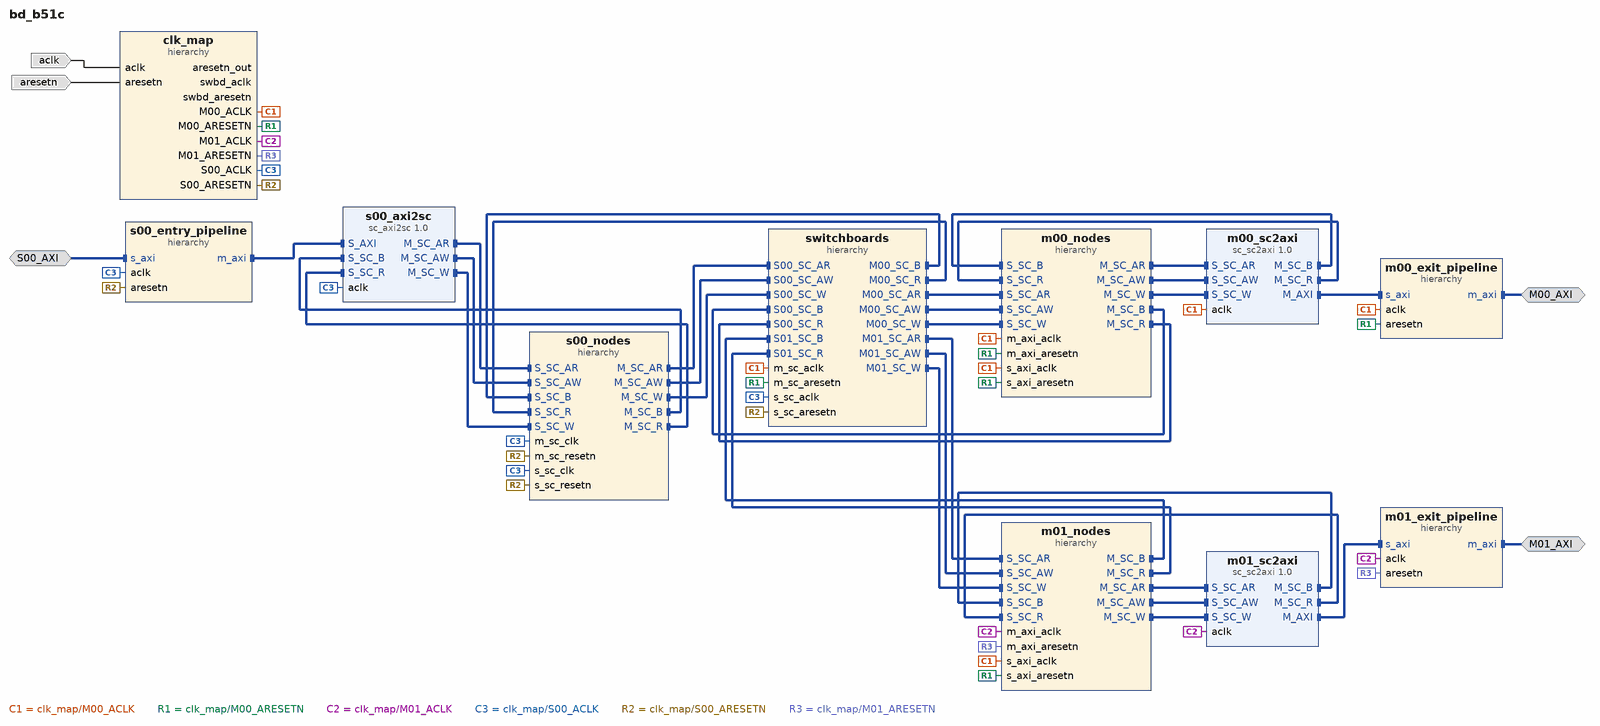
[diagram p0: block diagram of the top level]
# Vivado block design bd_b51c, xc7z007sclg400-1, Vivado 2024.2
create_bd_design bd_b51c

create_bd_intf_port -mode Slave -vlnv xilinx.com:interface:aximm_rtl:1.0 S00_AXI
set_property -dict {CONFIG.NUM_READ_OUTSTANDING 8 CONFIG.NUM_WRITE_OUTSTANDING 8} [get_bd_intf_ports S00_AXI]
create_bd_intf_port -mode Master -vlnv xilinx.com:interface:aximm_rtl:1.0 M00_AXI
set_property -dict [list \
  CONFIG.NUM_READ_OUTSTANDING 8 \
  CONFIG.NUM_READ_THREADS 1 \
  CONFIG.NUM_WRITE_OUTSTANDING 8 \
  CONFIG.NUM_WRITE_THREADS 1 \
  CONFIG.RUSER_BITS_PER_BYTE 0 \
  CONFIG.WUSER_BITS_PER_BYTE 0 \
] [get_bd_intf_ports M00_AXI]
create_bd_intf_port -mode Master -vlnv xilinx.com:interface:aximm_rtl:1.0 M01_AXI
set_property -dict [list \
  CONFIG.NUM_READ_OUTSTANDING 8 \
  CONFIG.NUM_READ_THREADS 1 \
  CONFIG.NUM_WRITE_OUTSTANDING 8 \
  CONFIG.NUM_WRITE_THREADS 1 \
  CONFIG.RUSER_BITS_PER_BYTE 0 \
  CONFIG.WUSER_BITS_PER_BYTE 0 \
] [get_bd_intf_ports M01_AXI]
create_bd_port -dir I -type clk aclk
set_property -dict {CONFIG.ASSOCIATED_BUSIF M00_AXI:M01_AXI:S00_AXI} [get_bd_ports aclk]
create_bd_port -dir I -type rst aresetn
set_property -dict {CONFIG.POLARITY ACTIVE_LOW} [get_bd_ports aresetn]

create_bd_cell -type hier clk_map
create_bd_cell -type hier switchboards
create_bd_cell -type hier s00_entry_pipeline
create_bd_cell -type ip -vlnv xilinx.com:ip:sc_axi2sc:1.0 s00_axi2sc
set_property -dict [list \
  CONFIG.AXI_ADDR_WIDTH 32 \
  CONFIG.AXI_ID_WIDTH 1 \
  CONFIG.AXI_RDATA_WIDTH 32 \
  CONFIG.AXI_WDATA_WIDTH 32 \
  CONFIG.MSC_ROUTE_WIDTH 4 \
  CONFIG.READ_WRITE_MODE READ_WRITE \
  CONFIG.SC_ADDR_WIDTH 32 \
  CONFIG.SC_ARUSER_WIDTH 0 \
  CONFIG.SC_AWUSER_WIDTH 0 \
  CONFIG.SC_BUSER_WIDTH 0 \
  CONFIG.SC_ID_WIDTH 1 \
  CONFIG.SC_RDATA_WIDTH 32 \
  CONFIG.SC_RUSER_BITS_PER_BYTE 0 \
  CONFIG.SC_WDATA_WIDTH 32 \
  CONFIG.SC_WUSER_BITS_PER_BYTE 0 \
  CONFIG.SSC_ROUTE_WIDTH 3 \
] [get_bd_cells s00_axi2sc]
create_bd_cell -type hier s00_nodes
create_bd_cell -type ip -vlnv xilinx.com:ip:sc_sc2axi:1.0 m00_sc2axi
set_property -dict [list \
  CONFIG.AXI_ADDR_WIDTH 9 \
  CONFIG.AXI_ID_WIDTH 1 \
  CONFIG.AXI_RDATA_WIDTH 32 \
  CONFIG.AXI_WDATA_WIDTH 32 \
  CONFIG.MSC_ROUTE_WIDTH 4 \
  CONFIG.READ_WRITE_MODE READ_WRITE \
  CONFIG.SC_ADDR_WIDTH 32 \
  CONFIG.SC_ARUSER_WIDTH 0 \
  CONFIG.SC_AWUSER_WIDTH 0 \
  CONFIG.SC_BUSER_WIDTH 0 \
  CONFIG.SC_ID_WIDTH 1 \
  CONFIG.SC_RDATA_WIDTH 32 \
  CONFIG.SC_RUSER_BITS_PER_BYTE 0 \
  CONFIG.SC_WDATA_WIDTH 32 \
  CONFIG.SC_WUSER_BITS_PER_BYTE 0 \
  CONFIG.SSC_ROUTE_WIDTH 3 \
] [get_bd_cells m00_sc2axi]
create_bd_cell -type hier m00_nodes
create_bd_cell -type hier m00_exit_pipeline
create_bd_cell -type ip -vlnv xilinx.com:ip:sc_sc2axi:1.0 m01_sc2axi
set_property -dict [list \
  CONFIG.AXI_ADDR_WIDTH 10 \
  CONFIG.AXI_ID_WIDTH 1 \
  CONFIG.AXI_RDATA_WIDTH 32 \
  CONFIG.AXI_WDATA_WIDTH 32 \
  CONFIG.MSC_ROUTE_WIDTH 4 \
  CONFIG.READ_WRITE_MODE READ_WRITE \
  CONFIG.SC_ADDR_WIDTH 32 \
  CONFIG.SC_ARUSER_WIDTH 0 \
  CONFIG.SC_AWUSER_WIDTH 0 \
  CONFIG.SC_BUSER_WIDTH 0 \
  CONFIG.SC_ID_WIDTH 1 \
  CONFIG.SC_RDATA_WIDTH 32 \
  CONFIG.SC_RUSER_BITS_PER_BYTE 0 \
  CONFIG.SC_WDATA_WIDTH 32 \
  CONFIG.SC_WUSER_BITS_PER_BYTE 0 \
  CONFIG.SSC_ROUTE_WIDTH 3 \
] [get_bd_cells m01_sc2axi]
create_bd_cell -type hier m01_nodes
create_bd_cell -type hier m01_exit_pipeline

# ---- hierarchy /clk_map ----
current_bd_instance /clk_map
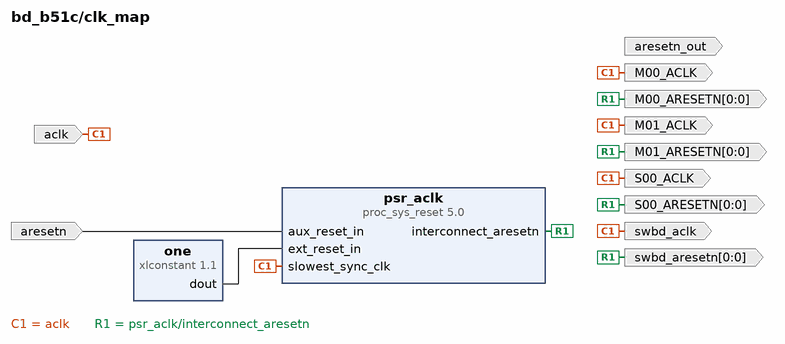
[diagram p1: block diagram inside /clk_map]
create_bd_pin -dir O -type clk S00_ACLK
create_bd_pin -dir O -from 0 -to 0 -type rst S00_ARESETN
create_bd_pin -dir O -type clk M00_ACLK
create_bd_pin -dir O -from 0 -to 0 -type rst M00_ARESETN
create_bd_pin -dir O -type clk M01_ACLK
create_bd_pin -dir O -from 0 -to 0 -type rst M01_ARESETN
create_bd_pin -dir O -type clk swbd_aclk
create_bd_pin -dir O -from 0 -to 0 -type rst swbd_aresetn
create_bd_pin -dir I -type rst aresetn
create_bd_pin -dir O -type rst aresetn_out
create_bd_pin -dir I -type clk aclk

create_bd_cell -type ip -vlnv xilinx.com:ip:xlconstant:1.1 one
create_bd_cell -type ip -vlnv xilinx.com:ip:proc_sys_reset:5.0 psr_aclk
set_property -dict {CONFIG.C_AUX_RESET_HIGH 0 CONFIG.C_AUX_RST_WIDTH 1} [get_bd_cells psr_aclk]

# ---- hierarchy /switchboards ----
current_bd_instance /switchboards
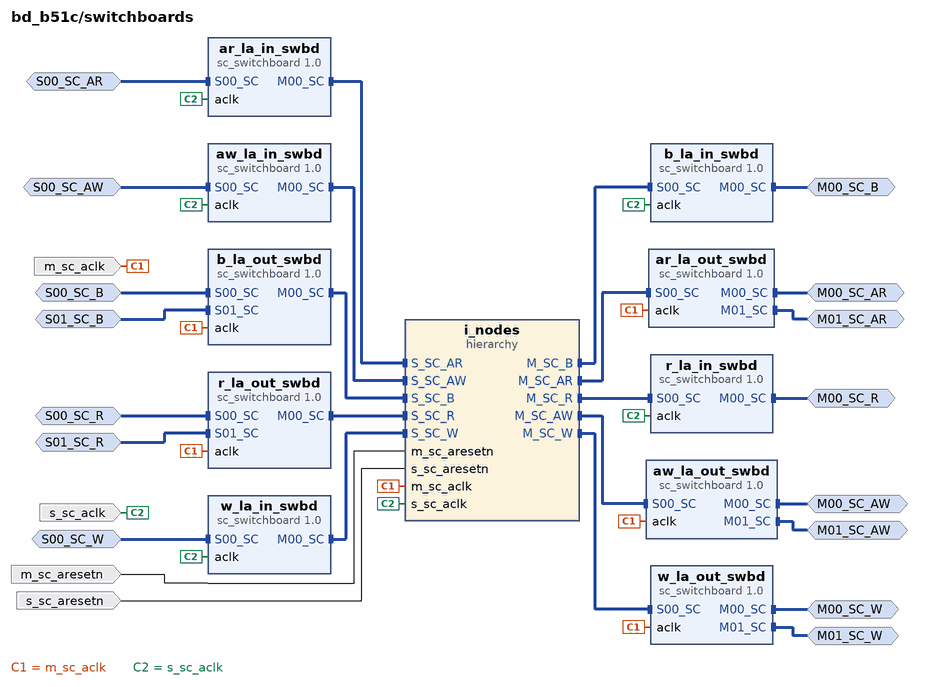
[diagram p2: block diagram inside /switchboards]
create_bd_intf_pin -mode Slave -vlnv xilinx.com:interface:sc_rtl:1.0 S00_SC_AR
create_bd_intf_pin -mode Slave -vlnv xilinx.com:interface:sc_rtl:1.0 S00_SC_AW
create_bd_intf_pin -mode Master -vlnv xilinx.com:interface:sc_rtl:1.0 M00_SC_B
create_bd_intf_pin -mode Master -vlnv xilinx.com:interface:sc_rtl:1.0 M00_SC_R
create_bd_intf_pin -mode Slave -vlnv xilinx.com:interface:sc_rtl:1.0 S00_SC_W
create_bd_intf_pin -mode Master -vlnv xilinx.com:interface:sc_rtl:1.0 M00_SC_AR
create_bd_intf_pin -mode Master -vlnv xilinx.com:interface:sc_rtl:1.0 M01_SC_AR
create_bd_intf_pin -mode Master -vlnv xilinx.com:interface:sc_rtl:1.0 M00_SC_AW
create_bd_intf_pin -mode Master -vlnv xilinx.com:interface:sc_rtl:1.0 M01_SC_AW
create_bd_intf_pin -mode Slave -vlnv xilinx.com:interface:sc_rtl:1.0 S00_SC_B
create_bd_intf_pin -mode Slave -vlnv xilinx.com:interface:sc_rtl:1.0 S01_SC_B
create_bd_intf_pin -mode Slave -vlnv xilinx.com:interface:sc_rtl:1.0 S00_SC_R
create_bd_intf_pin -mode Slave -vlnv xilinx.com:interface:sc_rtl:1.0 S01_SC_R
create_bd_intf_pin -mode Master -vlnv xilinx.com:interface:sc_rtl:1.0 M00_SC_W
create_bd_intf_pin -mode Master -vlnv xilinx.com:interface:sc_rtl:1.0 M01_SC_W
create_bd_pin -dir I -type clk s_sc_aclk
create_bd_pin -dir I -type clk m_sc_aclk
create_bd_pin -dir I -type rst s_sc_aresetn
create_bd_pin -dir I -type rst m_sc_aresetn

create_bd_cell -type ip -vlnv xilinx.com:ip:sc_switchboard:1.0 ar_la_in_swbd
set_property -dict {CONFIG.NUM_MI 1 CONFIG.NUM_SI 1 CONFIG.PAYLD_WIDTH 141} [get_bd_cells ar_la_in_swbd]
create_bd_cell -type ip -vlnv xilinx.com:ip:sc_switchboard:1.0 r_la_in_swbd
set_property -dict {CONFIG.NUM_MI 1 CONFIG.NUM_SI 1 CONFIG.PAYLD_WIDTH 53} [get_bd_cells r_la_in_swbd]
create_bd_cell -type ip -vlnv xilinx.com:ip:sc_switchboard:1.0 aw_la_in_swbd
set_property -dict {CONFIG.NUM_MI 1 CONFIG.NUM_SI 1 CONFIG.PAYLD_WIDTH 141} [get_bd_cells aw_la_in_swbd]
create_bd_cell -type ip -vlnv xilinx.com:ip:sc_switchboard:1.0 w_la_in_swbd
set_property -dict {CONFIG.NUM_MI 1 CONFIG.NUM_SI 1 CONFIG.PAYLD_WIDTH 55} [get_bd_cells w_la_in_swbd]
create_bd_cell -type ip -vlnv xilinx.com:ip:sc_switchboard:1.0 b_la_in_swbd
set_property -dict {CONFIG.NUM_MI 1 CONFIG.NUM_SI 1 CONFIG.PAYLD_WIDTH 7} [get_bd_cells b_la_in_swbd]
create_bd_cell -type ip -vlnv xilinx.com:ip:sc_switchboard:1.0 ar_la_out_swbd
set_property -dict {CONFIG.NUM_MI 2 CONFIG.NUM_SI 1 CONFIG.PAYLD_WIDTH 141} [get_bd_cells ar_la_out_swbd]
create_bd_cell -type ip -vlnv xilinx.com:ip:sc_switchboard:1.0 r_la_out_swbd
set_property -dict {CONFIG.NUM_MI 1 CONFIG.NUM_SI 2 CONFIG.PAYLD_WIDTH 53} [get_bd_cells r_la_out_swbd]
create_bd_cell -type ip -vlnv xilinx.com:ip:sc_switchboard:1.0 aw_la_out_swbd
set_property -dict {CONFIG.NUM_MI 2 CONFIG.NUM_SI 1 CONFIG.PAYLD_WIDTH 141} [get_bd_cells aw_la_out_swbd]
create_bd_cell -type ip -vlnv xilinx.com:ip:sc_switchboard:1.0 w_la_out_swbd
set_property -dict {CONFIG.NUM_MI 2 CONFIG.NUM_SI 1 CONFIG.PAYLD_WIDTH 55} [get_bd_cells w_la_out_swbd]
create_bd_cell -type ip -vlnv xilinx.com:ip:sc_switchboard:1.0 b_la_out_swbd
set_property -dict {CONFIG.NUM_MI 1 CONFIG.NUM_SI 2 CONFIG.PAYLD_WIDTH 7} [get_bd_cells b_la_out_swbd]
create_bd_cell -type hier i_nodes

# ---- hierarchy /switchboards/i_nodes ----
current_bd_instance /switchboards/i_nodes
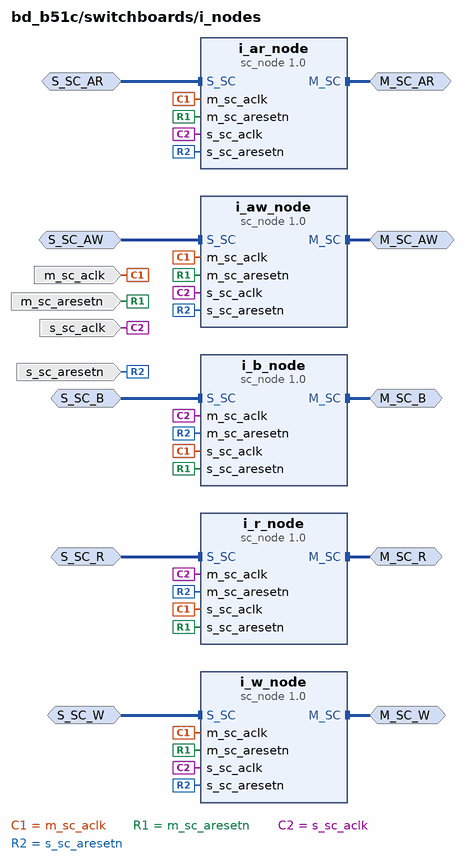
[diagram p3: block diagram inside /switchboards/i_nodes]
create_bd_intf_pin -mode Master -vlnv xilinx.com:interface:sc_rtl:1.0 M_SC_AR
create_bd_intf_pin -mode Slave -vlnv xilinx.com:interface:sc_rtl:1.0 S_SC_AR
create_bd_intf_pin -mode Master -vlnv xilinx.com:interface:sc_rtl:1.0 M_SC_R
create_bd_intf_pin -mode Slave -vlnv xilinx.com:interface:sc_rtl:1.0 S_SC_R
create_bd_intf_pin -mode Master -vlnv xilinx.com:interface:sc_rtl:1.0 M_SC_AW
create_bd_intf_pin -mode Slave -vlnv xilinx.com:interface:sc_rtl:1.0 S_SC_AW
create_bd_intf_pin -mode Master -vlnv xilinx.com:interface:sc_rtl:1.0 M_SC_W
create_bd_intf_pin -mode Slave -vlnv xilinx.com:interface:sc_rtl:1.0 S_SC_W
create_bd_intf_pin -mode Master -vlnv xilinx.com:interface:sc_rtl:1.0 M_SC_B
create_bd_intf_pin -mode Slave -vlnv xilinx.com:interface:sc_rtl:1.0 S_SC_B
create_bd_pin -dir I -type clk s_sc_aclk
create_bd_pin -dir I -type clk m_sc_aclk
create_bd_pin -dir I -type rst s_sc_aresetn
create_bd_pin -dir I -type rst m_sc_aresetn

create_bd_cell -type ip -vlnv xilinx.com:ip:sc_node:1.0 i_ar_node
set_property -dict [list \
  CONFIG.ACLKEN_CONVERSION 0 \
  CONFIG.ACLK_RELATIONSHIP 1 \
  CONFIG.ADDR_WIDTH 32 \
  CONFIG.CHANNEL 2 \
  CONFIG.FIFO_SIZE 0 \
  CONFIG.FIFO_TYPE 0 \
  CONFIG.ID_WIDTH 1 \
  CONFIG.M00_NUM_BYTES 4 \
  CONFIG.M01_NUM_BYTES 4 \
  CONFIG.M02_NUM_BYTES 4 \
  CONFIG.M03_NUM_BYTES 4 \
  CONFIG.M04_NUM_BYTES 4 \
  CONFIG.M05_NUM_BYTES 4 \
  CONFIG.M06_NUM_BYTES 4 \
  CONFIG.M07_NUM_BYTES 4 \
  CONFIG.M08_NUM_BYTES 4 \
  CONFIG.M09_NUM_BYTES 4 \
  CONFIG.M10_NUM_BYTES 4 \
  CONFIG.M11_NUM_BYTES 4 \
  CONFIG.M12_NUM_BYTES 4 \
  CONFIG.M13_NUM_BYTES 4 \
  CONFIG.M14_NUM_BYTES 4 \
  CONFIG.M15_NUM_BYTES 4 \
  CONFIG.MAX_PAYLD_BYTES 4 \
  CONFIG.M_SEND_PIPELINE 0 \
  CONFIG.NUM_MI 2 \
  CONFIG.NUM_OUTSTANDING 8 \
  CONFIG.NUM_SI 1 \
  CONFIG.PAYLD_WIDTH 141 \
  CONFIG.S00_NUM_BYTES 4 \
  CONFIG.S01_NUM_BYTES 4 \
  CONFIG.S02_NUM_BYTES 4 \
  CONFIG.S03_NUM_BYTES 4 \
  CONFIG.S04_NUM_BYTES 4 \
  CONFIG.S05_NUM_BYTES 4 \
  CONFIG.S06_NUM_BYTES 4 \
  CONFIG.S07_NUM_BYTES 4 \
  CONFIG.S08_NUM_BYTES 4 \
  CONFIG.S09_NUM_BYTES 4 \
  CONFIG.S10_NUM_BYTES 4 \
  CONFIG.S11_NUM_BYTES 4 \
  CONFIG.S12_NUM_BYTES 4 \
  CONFIG.S13_NUM_BYTES 4 \
  CONFIG.S14_NUM_BYTES 4 \
  CONFIG.S15_NUM_BYTES 4 \
  CONFIG.SC_ROUTE_WIDTH 4 \
  CONFIG.USER_WIDTH 0 \
] [get_bd_cells i_ar_node]
create_bd_cell -type ip -vlnv xilinx.com:ip:sc_node:1.0 i_r_node
set_property -dict [list \
  CONFIG.ACLKEN_CONVERSION 0 \
  CONFIG.ACLK_RELATIONSHIP 1 \
  CONFIG.ADDR_WIDTH 32 \
  CONFIG.CHANNEL 0 \
  CONFIG.FIFO_SIZE 0 \
  CONFIG.FIFO_TYPE 0 \
  CONFIG.ID_WIDTH 1 \
  CONFIG.M00_NUM_BYTES 4 \
  CONFIG.M01_NUM_BYTES 4 \
  CONFIG.M02_NUM_BYTES 4 \
  CONFIG.M03_NUM_BYTES 4 \
  CONFIG.M04_NUM_BYTES 4 \
  CONFIG.M05_NUM_BYTES 4 \
  CONFIG.M06_NUM_BYTES 4 \
  CONFIG.M07_NUM_BYTES 4 \
  CONFIG.M08_NUM_BYTES 4 \
  CONFIG.M09_NUM_BYTES 4 \
  CONFIG.M10_NUM_BYTES 4 \
  CONFIG.M11_NUM_BYTES 4 \
  CONFIG.M12_NUM_BYTES 4 \
  CONFIG.M13_NUM_BYTES 4 \
  CONFIG.M14_NUM_BYTES 4 \
  CONFIG.M15_NUM_BYTES 4 \
  CONFIG.MAX_PAYLD_BYTES 4 \
  CONFIG.M_SEND_PIPELINE 0 \
  CONFIG.NUM_MI 1 \
  CONFIG.NUM_OUTSTANDING 8 \
  CONFIG.NUM_SI 2 \
  CONFIG.PAYLD_WIDTH 53 \
  CONFIG.S00_NUM_BYTES 4 \
  CONFIG.S01_NUM_BYTES 4 \
  CONFIG.S02_NUM_BYTES 4 \
  CONFIG.S03_NUM_BYTES 4 \
  CONFIG.S04_NUM_BYTES 4 \
  CONFIG.S05_NUM_BYTES 4 \
  CONFIG.S06_NUM_BYTES 4 \
  CONFIG.S07_NUM_BYTES 4 \
  CONFIG.S08_NUM_BYTES 4 \
  CONFIG.S09_NUM_BYTES 4 \
  CONFIG.S10_NUM_BYTES 4 \
  CONFIG.S11_NUM_BYTES 4 \
  CONFIG.S12_NUM_BYTES 4 \
  CONFIG.S13_NUM_BYTES 4 \
  CONFIG.S14_NUM_BYTES 4 \
  CONFIG.S15_NUM_BYTES 4 \
  CONFIG.SC_ROUTE_WIDTH 3 \
  CONFIG.USER_BITS_PER_BYTE 0 \
] [get_bd_cells i_r_node]
create_bd_cell -type ip -vlnv xilinx.com:ip:sc_node:1.0 i_aw_node
set_property -dict [list \
  CONFIG.ACLKEN_CONVERSION 0 \
  CONFIG.ACLK_RELATIONSHIP 1 \
  CONFIG.ADDR_WIDTH 32 \
  CONFIG.CHANNEL 3 \
  CONFIG.FIFO_SIZE 0 \
  CONFIG.FIFO_TYPE 0 \
  CONFIG.ID_WIDTH 1 \
  CONFIG.M00_NUM_BYTES 4 \
  CONFIG.M01_NUM_BYTES 4 \
  CONFIG.M02_NUM_BYTES 4 \
  CONFIG.M03_NUM_BYTES 4 \
  CONFIG.M04_NUM_BYTES 4 \
  CONFIG.M05_NUM_BYTES 4 \
  CONFIG.M06_NUM_BYTES 4 \
  CONFIG.M07_NUM_BYTES 4 \
  CONFIG.M08_NUM_BYTES 4 \
  CONFIG.M09_NUM_BYTES 4 \
  CONFIG.M10_NUM_BYTES 4 \
  CONFIG.M11_NUM_BYTES 4 \
  CONFIG.M12_NUM_BYTES 4 \
  CONFIG.M13_NUM_BYTES 4 \
  CONFIG.M14_NUM_BYTES 4 \
  CONFIG.M15_NUM_BYTES 4 \
  CONFIG.MAX_PAYLD_BYTES 4 \
  CONFIG.M_SEND_PIPELINE 0 \
  CONFIG.NUM_MI 2 \
  CONFIG.NUM_OUTSTANDING 8 \
  CONFIG.NUM_SI 1 \
  CONFIG.PAYLD_WIDTH 141 \
  CONFIG.S00_NUM_BYTES 4 \
  CONFIG.S01_NUM_BYTES 4 \
  CONFIG.S02_NUM_BYTES 4 \
  CONFIG.S03_NUM_BYTES 4 \
  CONFIG.S04_NUM_BYTES 4 \
  CONFIG.S05_NUM_BYTES 4 \
  CONFIG.S06_NUM_BYTES 4 \
  CONFIG.S07_NUM_BYTES 4 \
  CONFIG.S08_NUM_BYTES 4 \
  CONFIG.S09_NUM_BYTES 4 \
  CONFIG.S10_NUM_BYTES 4 \
  CONFIG.S11_NUM_BYTES 4 \
  CONFIG.S12_NUM_BYTES 4 \
  CONFIG.S13_NUM_BYTES 4 \
  CONFIG.S14_NUM_BYTES 4 \
  CONFIG.S15_NUM_BYTES 4 \
  CONFIG.SC_ROUTE_WIDTH 4 \
  CONFIG.USER_WIDTH 0 \
] [get_bd_cells i_aw_node]
create_bd_cell -type ip -vlnv xilinx.com:ip:sc_node:1.0 i_w_node
set_property -dict [list \
  CONFIG.ACLKEN_CONVERSION 0 \
  CONFIG.ACLK_RELATIONSHIP 1 \
  CONFIG.ADDR_WIDTH 32 \
  CONFIG.CHANNEL 1 \
  CONFIG.FIFO_SIZE 0 \
  CONFIG.FIFO_TYPE 0 \
  CONFIG.ID_WIDTH 1 \
  CONFIG.M00_NUM_BYTES 4 \
  CONFIG.M01_NUM_BYTES 4 \
  CONFIG.M02_NUM_BYTES 4 \
  CONFIG.M03_NUM_BYTES 4 \
  CONFIG.M04_NUM_BYTES 4 \
  CONFIG.M05_NUM_BYTES 4 \
  CONFIG.M06_NUM_BYTES 4 \
  CONFIG.M07_NUM_BYTES 4 \
  CONFIG.M08_NUM_BYTES 4 \
  CONFIG.M09_NUM_BYTES 4 \
  CONFIG.M10_NUM_BYTES 4 \
  CONFIG.M11_NUM_BYTES 4 \
  CONFIG.M12_NUM_BYTES 4 \
  CONFIG.M13_NUM_BYTES 4 \
  CONFIG.M14_NUM_BYTES 4 \
  CONFIG.M15_NUM_BYTES 4 \
  CONFIG.MAX_PAYLD_BYTES 4 \
  CONFIG.M_SEND_PIPELINE 0 \
  CONFIG.NUM_MI 2 \
  CONFIG.NUM_OUTSTANDING 8 \
  CONFIG.NUM_SI 1 \
  CONFIG.PAYLD_WIDTH 55 \
  CONFIG.S00_NUM_BYTES 4 \
  CONFIG.S01_NUM_BYTES 4 \
  CONFIG.S02_NUM_BYTES 4 \
  CONFIG.S03_NUM_BYTES 4 \
  CONFIG.S04_NUM_BYTES 4 \
  CONFIG.S05_NUM_BYTES 4 \
  CONFIG.S06_NUM_BYTES 4 \
  CONFIG.S07_NUM_BYTES 4 \
  CONFIG.S08_NUM_BYTES 4 \
  CONFIG.S09_NUM_BYTES 4 \
  CONFIG.S10_NUM_BYTES 4 \
  CONFIG.S11_NUM_BYTES 4 \
  CONFIG.S12_NUM_BYTES 4 \
  CONFIG.S13_NUM_BYTES 4 \
  CONFIG.S14_NUM_BYTES 4 \
  CONFIG.S15_NUM_BYTES 4 \
  CONFIG.SC_ROUTE_WIDTH 4 \
  CONFIG.USER_BITS_PER_BYTE 0 \
] [get_bd_cells i_w_node]
create_bd_cell -type ip -vlnv xilinx.com:ip:sc_node:1.0 i_b_node
set_property -dict [list \
  CONFIG.ACLKEN_CONVERSION 0 \
  CONFIG.ACLK_RELATIONSHIP 1 \
  CONFIG.ADDR_WIDTH 32 \
  CONFIG.CHANNEL 4 \
  CONFIG.FIFO_SIZE 0 \
  CONFIG.FIFO_TYPE 0 \
  CONFIG.ID_WIDTH 1 \
  CONFIG.M00_NUM_BYTES 4 \
  CONFIG.M01_NUM_BYTES 4 \
  CONFIG.M02_NUM_BYTES 4 \
  CONFIG.M03_NUM_BYTES 4 \
  CONFIG.M04_NUM_BYTES 4 \
  CONFIG.M05_NUM_BYTES 4 \
  CONFIG.M06_NUM_BYTES 4 \
  CONFIG.M07_NUM_BYTES 4 \
  CONFIG.M08_NUM_BYTES 4 \
  CONFIG.M09_NUM_BYTES 4 \
  CONFIG.M10_NUM_BYTES 4 \
  CONFIG.M11_NUM_BYTES 4 \
  CONFIG.M12_NUM_BYTES 4 \
  CONFIG.M13_NUM_BYTES 4 \
  CONFIG.M14_NUM_BYTES 4 \
  CONFIG.M15_NUM_BYTES 4 \
  CONFIG.MAX_PAYLD_BYTES 4 \
  CONFIG.M_SEND_PIPELINE 0 \
  CONFIG.NUM_MI 1 \
  CONFIG.NUM_OUTSTANDING 8 \
  CONFIG.NUM_SI 2 \
  CONFIG.PAYLD_WIDTH 7 \
  CONFIG.S00_NUM_BYTES 4 \
  CONFIG.S01_NUM_BYTES 4 \
  CONFIG.S02_NUM_BYTES 4 \
  CONFIG.S03_NUM_BYTES 4 \
  CONFIG.S04_NUM_BYTES 4 \
  CONFIG.S05_NUM_BYTES 4 \
  CONFIG.S06_NUM_BYTES 4 \
  CONFIG.S07_NUM_BYTES 4 \
  CONFIG.S08_NUM_BYTES 4 \
  CONFIG.S09_NUM_BYTES 4 \
  CONFIG.S10_NUM_BYTES 4 \
  CONFIG.S11_NUM_BYTES 4 \
  CONFIG.S12_NUM_BYTES 4 \
  CONFIG.S13_NUM_BYTES 4 \
  CONFIG.S14_NUM_BYTES 4 \
  CONFIG.S15_NUM_BYTES 4 \
  CONFIG.SC_ROUTE_WIDTH 3 \
  CONFIG.USER_WIDTH 0 \
] [get_bd_cells i_b_node]

# ---- hierarchy /s00_entry_pipeline ----
current_bd_instance /s00_entry_pipeline
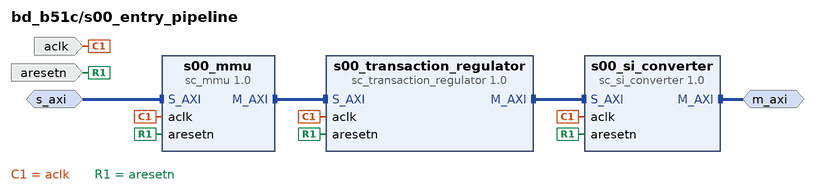
[diagram p4: block diagram inside /s00_entry_pipeline]
create_bd_intf_pin -mode Slave -vlnv xilinx.com:interface:aximm_rtl:1.0 s_axi
create_bd_intf_pin -mode Master -vlnv xilinx.com:interface:aximm_rtl:1.0 m_axi
create_bd_pin -dir I -type clk aclk
create_bd_pin -dir I -type rst aresetn

create_bd_cell -type ip -vlnv xilinx.com:ip:sc_mmu:1.0 s00_mmu
set_property -dict [list \
  CONFIG.ADDR_WIDTH 32 \
  CONFIG.ENABLE_PIPELINING 0 \
  CONFIG.ID_WIDTH 12 \
  CONFIG.IS_CASCADED 0 \
  CONFIG.MSC000_ROUTE 0b1011 \
  CONFIG.MSC001_ROUTE 0b1101 \
  CONFIG.MSC_ROUTE_WIDTH 4 \
  CONFIG.NUM_MSC 2 \
  CONFIG.NUM_READ_OUTSTANDING 8 \
  CONFIG.NUM_SEG 1 \
  CONFIG.NUM_WRITE_OUTSTANDING 8 \
  CONFIG.RDATA_WIDTH 32 \
  CONFIG.READ_WRITE_MODE READ_WRITE \
  CONFIG.SEG000_BASE_ADDR 0x0000000040400000 \
  CONFIG.SEG000_SECURE_READ 0 \
  CONFIG.SEG000_SECURE_WRITE 0 \
  CONFIG.SEG000_SEP_ROUTE 0b0000000000000000000000000000000000000000000000000000000000000001 \
  CONFIG.SEG000_SIZE 16 \
  CONFIG.SEG000_SUPPORTS_READ 1 \
  CONFIG.SEG000_SUPPORTS_WRITE 1 \
  CONFIG.SINGLE_ISSUING 1 \
  CONFIG.SUPPORTS_NARROW 0 \
  CONFIG.SUPPORTS_WRAP 0 \
  CONFIG.S_ARUSER_WIDTH 0 \
  CONFIG.S_AWUSER_WIDTH 0 \
  CONFIG.S_BUSER_WIDTH 0 \
  CONFIG.S_PROTOCOL AXI3 \
  CONFIG.S_RUSER_WIDTH 0 \
  CONFIG.S_WUSER_WIDTH 0 \
  CONFIG.WDATA_WIDTH 32 \
] [get_bd_cells s00_mmu]
create_bd_cell -type ip -vlnv xilinx.com:ip:sc_transaction_regulator:1.0 s00_transaction_regulator
set_property -dict [list \
  CONFIG.ADDR_WIDTH 32 \
  CONFIG.IS_CASCADED 0 \
  CONFIG.MEP_IDENTIFIER 1 \
  CONFIG.MEP_IDENTIFIER_WIDTH 1 \
  CONFIG.NUM_READ_OUTSTANDING 8 \
  CONFIG.NUM_READ_THREADS 1 \
  CONFIG.NUM_WRITE_OUTSTANDING 8 \
  CONFIG.NUM_WRITE_THREADS 1 \
  CONFIG.RDATA_WIDTH 32 \
  CONFIG.READ_WRITE_MODE READ_WRITE \
  CONFIG.SEP_ROUTE_WIDTH 1 \
  CONFIG.SINGLE_ISSUING 1 \
  CONFIG.SUPPORTS_READ_DEADLOCK 0 \
  CONFIG.SUPPORTS_WRITE_DEADLOCK 0 \
  CONFIG.S_ID_WIDTH 12 \
  CONFIG.WDATA_WIDTH 32 \
] [get_bd_cells s00_transaction_regulator]
create_bd_cell -type ip -vlnv xilinx.com:ip:sc_si_converter:1.0 s00_si_converter
set_property -dict [list \
  CONFIG.ADDR_WIDTH 32 \
  CONFIG.AXILITE_CONV 1 \
  CONFIG.HAS_BURST 1 \
  CONFIG.ID_WIDTH 1 \
  CONFIG.IS_CASCADED 0 \
  CONFIG.LIMIT_READ_LENGTH 0 \
  CONFIG.LIMIT_WRITE_LENGTH 0 \
  CONFIG.MAX_RUSER_BITS_PER_BYTE 0 \
  CONFIG.MAX_WUSER_BITS_PER_BYTE 0 \
  CONFIG.MEP_IDENTIFIER_WIDTH 1 \
  CONFIG.MSC000_RDATA_WIDTH 32 \
  CONFIG.MSC000_WDATA_WIDTH 32 \
  CONFIG.MSC001_RDATA_WIDTH 32 \
  CONFIG.MSC001_WDATA_WIDTH 32 \
  CONFIG.NUM_MSC 2 \
  CONFIG.NUM_READ_OUTSTANDING 8 \
  CONFIG.NUM_READ_THREADS 1 \
  CONFIG.NUM_SEG 1 \
  CONFIG.NUM_WRITE_OUTSTANDING 8 \
  CONFIG.NUM_WRITE_THREADS 1 \
  CONFIG.RDATA_WIDTH 32 \
  CONFIG.READ_WATERMARK 0 \
  CONFIG.READ_WRITE_MODE READ_WRITE \
  CONFIG.SEP000_PROTOCOL AXI4LITE \
  CONFIG.SEP000_RDATA_WIDTH 32 \
  CONFIG.SEP000_WDATA_WIDTH 32 \
  CONFIG.SINGLE_ISSUING 1 \
  CONFIG.SUPPORTS_NARROW 0 \
  CONFIG.S_RUSER_BITS_PER_BYTE 0 \
  CONFIG.S_WUSER_BITS_PER_BYTE 0 \
  CONFIG.WDATA_WIDTH 32 \
  CONFIG.WRITE_WATERMARK 0 \
] [get_bd_cells s00_si_converter]

# ---- hierarchy /s00_nodes ----
current_bd_instance /s00_nodes
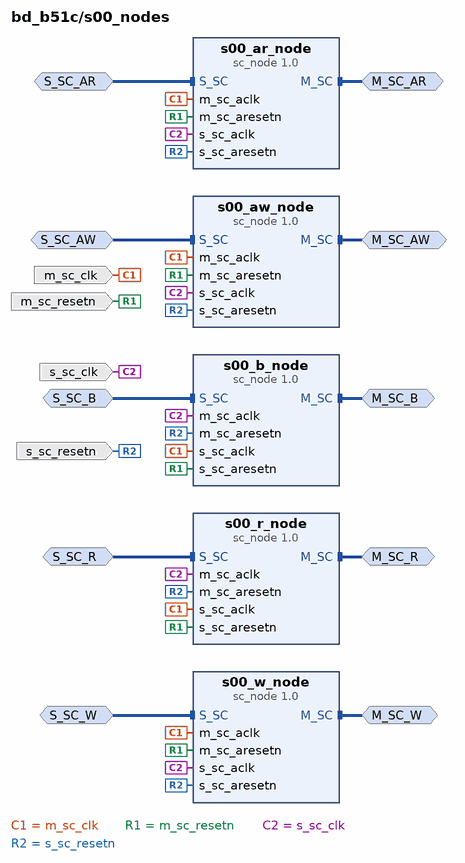
[diagram p5: block diagram inside /s00_nodes]
create_bd_intf_pin -mode Master -vlnv xilinx.com:interface:sc_rtl:1.0 M_SC_AR
create_bd_intf_pin -mode Slave -vlnv xilinx.com:interface:sc_rtl:1.0 S_SC_AR
create_bd_intf_pin -mode Master -vlnv xilinx.com:interface:sc_rtl:1.0 M_SC_R
create_bd_intf_pin -mode Slave -vlnv xilinx.com:interface:sc_rtl:1.0 S_SC_R
create_bd_intf_pin -mode Master -vlnv xilinx.com:interface:sc_rtl:1.0 M_SC_AW
create_bd_intf_pin -mode Slave -vlnv xilinx.com:interface:sc_rtl:1.0 S_SC_AW
create_bd_intf_pin -mode Master -vlnv xilinx.com:interface:sc_rtl:1.0 M_SC_W
create_bd_intf_pin -mode Slave -vlnv xilinx.com:interface:sc_rtl:1.0 S_SC_W
create_bd_intf_pin -mode Master -vlnv xilinx.com:interface:sc_rtl:1.0 M_SC_B
create_bd_intf_pin -mode Slave -vlnv xilinx.com:interface:sc_rtl:1.0 S_SC_B
create_bd_pin -dir I -type clk s_sc_clk
create_bd_pin -dir I -type rst s_sc_resetn
create_bd_pin -dir I -type clk m_sc_clk
create_bd_pin -dir I -type rst m_sc_resetn

create_bd_cell -type ip -vlnv xilinx.com:ip:sc_node:1.0 s00_ar_node
set_property -dict [list \
  CONFIG.ACLKEN_CONVERSION 0 \
  CONFIG.ACLK_RELATIONSHIP 1 \
  CONFIG.ADDR_WIDTH 32 \
  CONFIG.CHANNEL 2 \
  CONFIG.FIFO_TYPE 2 \
  CONFIG.ID_WIDTH 1 \
  CONFIG.M00_NUM_BYTES 4 \
  CONFIG.M01_NUM_BYTES 4 \
  CONFIG.M02_NUM_BYTES 4 \
  CONFIG.M03_NUM_BYTES 4 \
  CONFIG.M04_NUM_BYTES 4 \
  CONFIG.M05_NUM_BYTES 4 \
  CONFIG.M06_NUM_BYTES 4 \
  CONFIG.M07_NUM_BYTES 4 \
  CONFIG.M08_NUM_BYTES 4 \
  CONFIG.M09_NUM_BYTES 4 \
  CONFIG.M10_NUM_BYTES 4 \
  CONFIG.M11_NUM_BYTES 4 \
  CONFIG.M12_NUM_BYTES 4 \
  CONFIG.M13_NUM_BYTES 4 \
  CONFIG.M14_NUM_BYTES 4 \
  CONFIG.M15_NUM_BYTES 4 \
  CONFIG.MAX_PAYLD_BYTES 4 \
  CONFIG.NUM_MI 1 \
  CONFIG.NUM_OUTSTANDING 8 \
  CONFIG.NUM_SI 1 \
  CONFIG.PAYLD_WIDTH 141 \
  CONFIG.S00_NUM_BYTES 4 \
  CONFIG.S01_NUM_BYTES 4 \
  CONFIG.S02_NUM_BYTES 4 \
  CONFIG.S03_NUM_BYTES 4 \
  CONFIG.S04_NUM_BYTES 4 \
  CONFIG.S05_NUM_BYTES 4 \
  CONFIG.S06_NUM_BYTES 4 \
  CONFIG.S07_NUM_BYTES 4 \
  CONFIG.S08_NUM_BYTES 4 \
  CONFIG.S09_NUM_BYTES 4 \
  CONFIG.S10_NUM_BYTES 4 \
  CONFIG.S11_NUM_BYTES 4 \
  CONFIG.S12_NUM_BYTES 4 \
  CONFIG.S13_NUM_BYTES 4 \
  CONFIG.S14_NUM_BYTES 4 \
  CONFIG.S15_NUM_BYTES 4 \
  CONFIG.SC_ROUTE_WIDTH 4 \
  CONFIG.USER_WIDTH 0 \
] [get_bd_cells s00_ar_node]
create_bd_cell -type ip -vlnv xilinx.com:ip:sc_node:1.0 s00_r_node
set_property -dict [list \
  CONFIG.ACLKEN_CONVERSION 0 \
  CONFIG.ACLK_RELATIONSHIP 1 \
  CONFIG.ADDR_WIDTH 32 \
  CONFIG.CHANNEL 0 \
  CONFIG.FIFO_TYPE 2 \
  CONFIG.ID_WIDTH 1 \
  CONFIG.M00_NUM_BYTES 4 \
  CONFIG.M01_NUM_BYTES 4 \
  CONFIG.M02_NUM_BYTES 4 \
  CONFIG.M03_NUM_BYTES 4 \
  CONFIG.M04_NUM_BYTES 4 \
  CONFIG.M05_NUM_BYTES 4 \
  CONFIG.M06_NUM_BYTES 4 \
  CONFIG.M07_NUM_BYTES 4 \
  CONFIG.M08_NUM_BYTES 4 \
  CONFIG.M09_NUM_BYTES 4 \
  CONFIG.M10_NUM_BYTES 4 \
  CONFIG.M11_NUM_BYTES 4 \
  CONFIG.M12_NUM_BYTES 4 \
  CONFIG.M13_NUM_BYTES 4 \
  CONFIG.M14_NUM_BYTES 4 \
  CONFIG.M15_NUM_BYTES 4 \
  CONFIG.MAX_PAYLD_BYTES 4 \
  CONFIG.M_SEND_PIPELINE 0 \
  CONFIG.NUM_MI 1 \
  CONFIG.NUM_OUTSTANDING 8 \
  CONFIG.NUM_SI 1 \
  CONFIG.PAYLD_WIDTH 53 \
  CONFIG.S00_NUM_BYTES 4 \
  CONFIG.S01_NUM_BYTES 4 \
  CONFIG.S02_NUM_BYTES 4 \
  CONFIG.S03_NUM_BYTES 4 \
  CONFIG.S04_NUM_BYTES 4 \
  CONFIG.S05_NUM_BYTES 4 \
  CONFIG.S06_NUM_BYTES 4 \
  CONFIG.S07_NUM_BYTES 4 \
  CONFIG.S08_NUM_BYTES 4 \
  CONFIG.S09_NUM_BYTES 4 \
  CONFIG.S10_NUM_BYTES 4 \
  CONFIG.S11_NUM_BYTES 4 \
  CONFIG.S12_NUM_BYTES 4 \
  CONFIG.S13_NUM_BYTES 4 \
  CONFIG.S14_NUM_BYTES 4 \
  CONFIG.S15_NUM_BYTES 4 \
  CONFIG.SC_ROUTE_WIDTH 3 \
  CONFIG.USER_BITS_PER_BYTE 0 \
] [get_bd_cells s00_r_node]
create_bd_cell -type ip -vlnv xilinx.com:ip:sc_node:1.0 s00_aw_node
set_property -dict [list \
  CONFIG.ACLKEN_CONVERSION 0 \
  CONFIG.ACLK_RELATIONSHIP 1 \
  CONFIG.ADDR_WIDTH 32 \
  CONFIG.CHANNEL 3 \
  CONFIG.FIFO_TYPE 2 \
  CONFIG.ID_WIDTH 1 \
  CONFIG.M00_NUM_BYTES 4 \
  CONFIG.M01_NUM_BYTES 4 \
  CONFIG.M02_NUM_BYTES 4 \
  CONFIG.M03_NUM_BYTES 4 \
  CONFIG.M04_NUM_BYTES 4 \
  CONFIG.M05_NUM_BYTES 4 \
  CONFIG.M06_NUM_BYTES 4 \
  CONFIG.M07_NUM_BYTES 4 \
  CONFIG.M08_NUM_BYTES 4 \
  CONFIG.M09_NUM_BYTES 4 \
  CONFIG.M10_NUM_BYTES 4 \
  CONFIG.M11_NUM_BYTES 4 \
  CONFIG.M12_NUM_BYTES 4 \
  CONFIG.M13_NUM_BYTES 4 \
  CONFIG.M14_NUM_BYTES 4 \
  CONFIG.M15_NUM_BYTES 4 \
  CONFIG.MAX_PAYLD_BYTES 4 \
  CONFIG.NUM_MI 1 \
  CONFIG.NUM_OUTSTANDING 8 \
  CONFIG.NUM_SI 1 \
  CONFIG.PAYLD_WIDTH 141 \
  CONFIG.S00_NUM_BYTES 4 \
  CONFIG.S01_NUM_BYTES 4 \
  CONFIG.S02_NUM_BYTES 4 \
  CONFIG.S03_NUM_BYTES 4 \
  CONFIG.S04_NUM_BYTES 4 \
  CONFIG.S05_NUM_BYTES 4 \
  CONFIG.S06_NUM_BYTES 4 \
  CONFIG.S07_NUM_BYTES 4 \
  CONFIG.S08_NUM_BYTES 4 \
  CONFIG.S09_NUM_BYTES 4 \
  CONFIG.S10_NUM_BYTES 4 \
  CONFIG.S11_NUM_BYTES 4 \
  CONFIG.S12_NUM_BYTES 4 \
  CONFIG.S13_NUM_BYTES 4 \
  CONFIG.S14_NUM_BYTES 4 \
  CONFIG.S15_NUM_BYTES 4 \
  CONFIG.SC_ROUTE_WIDTH 4 \
  CONFIG.USER_WIDTH 0 \
] [get_bd_cells s00_aw_node]
create_bd_cell -type ip -vlnv xilinx.com:ip:sc_node:1.0 s00_w_node
set_property -dict [list \
  CONFIG.ACLKEN_CONVERSION 0 \
  CONFIG.ACLK_RELATIONSHIP 1 \
  CONFIG.ADDR_WIDTH 32 \
  CONFIG.CHANNEL 1 \
  CONFIG.FIFO_TYPE 2 \
  CONFIG.ID_WIDTH 1 \
  CONFIG.M00_NUM_BYTES 4 \
  CONFIG.M01_NUM_BYTES 4 \
  CONFIG.M02_NUM_BYTES 4 \
  CONFIG.M03_NUM_BYTES 4 \
  CONFIG.M04_NUM_BYTES 4 \
  CONFIG.M05_NUM_BYTES 4 \
  CONFIG.M06_NUM_BYTES 4 \
  CONFIG.M07_NUM_BYTES 4 \
  CONFIG.M08_NUM_BYTES 4 \
  CONFIG.M09_NUM_BYTES 4 \
  CONFIG.M10_NUM_BYTES 4 \
  CONFIG.M11_NUM_BYTES 4 \
  CONFIG.M12_NUM_BYTES 4 \
  CONFIG.M13_NUM_BYTES 4 \
  CONFIG.M14_NUM_BYTES 4 \
  CONFIG.M15_NUM_BYTES 4 \
  CONFIG.MAX_PAYLD_BYTES 4 \
  CONFIG.NUM_MI 1 \
  CONFIG.NUM_OUTSTANDING 8 \
  CONFIG.NUM_SI 1 \
  CONFIG.PAYLD_WIDTH 55 \
  CONFIG.S00_NUM_BYTES 4 \
  CONFIG.S01_NUM_BYTES 4 \
  CONFIG.S02_NUM_BYTES 4 \
  CONFIG.S03_NUM_BYTES 4 \
  CONFIG.S04_NUM_BYTES 4 \
  CONFIG.S05_NUM_BYTES 4 \
  CONFIG.S06_NUM_BYTES 4 \
  CONFIG.S07_NUM_BYTES 4 \
  CONFIG.S08_NUM_BYTES 4 \
  CONFIG.S09_NUM_BYTES 4 \
  CONFIG.S10_NUM_BYTES 4 \
  CONFIG.S11_NUM_BYTES 4 \
  CONFIG.S12_NUM_BYTES 4 \
  CONFIG.S13_NUM_BYTES 4 \
  CONFIG.S14_NUM_BYTES 4 \
  CONFIG.S15_NUM_BYTES 4 \
  CONFIG.SC_ROUTE_WIDTH 4 \
  CONFIG.USER_BITS_PER_BYTE 0 \
] [get_bd_cells s00_w_node]
create_bd_cell -type ip -vlnv xilinx.com:ip:sc_node:1.0 s00_b_node
set_property -dict [list \
  CONFIG.ACLKEN_CONVERSION 0 \
  CONFIG.ACLK_RELATIONSHIP 1 \
  CONFIG.ADDR_WIDTH 32 \
  CONFIG.CHANNEL 4 \
  CONFIG.FIFO_TYPE 2 \
  CONFIG.ID_WIDTH 1 \
  CONFIG.M00_NUM_BYTES 4 \
  CONFIG.M01_NUM_BYTES 4 \
  CONFIG.M02_NUM_BYTES 4 \
  CONFIG.M03_NUM_BYTES 4 \
  CONFIG.M04_NUM_BYTES 4 \
  CONFIG.M05_NUM_BYTES 4 \
  CONFIG.M06_NUM_BYTES 4 \
  CONFIG.M07_NUM_BYTES 4 \
  CONFIG.M08_NUM_BYTES 4 \
  CONFIG.M09_NUM_BYTES 4 \
  CONFIG.M10_NUM_BYTES 4 \
  CONFIG.M11_NUM_BYTES 4 \
  CONFIG.M12_NUM_BYTES 4 \
  CONFIG.M13_NUM_BYTES 4 \
  CONFIG.M14_NUM_BYTES 4 \
  CONFIG.M15_NUM_BYTES 4 \
  CONFIG.MAX_PAYLD_BYTES 4 \
  CONFIG.M_SEND_PIPELINE 0 \
  CONFIG.NUM_MI 1 \
  CONFIG.NUM_OUTSTANDING 8 \
  CONFIG.NUM_SI 1 \
  CONFIG.PAYLD_WIDTH 7 \
  CONFIG.S00_NUM_BYTES 4 \
  CONFIG.S01_NUM_BYTES 4 \
  CONFIG.S02_NUM_BYTES 4 \
  CONFIG.S03_NUM_BYTES 4 \
  CONFIG.S04_NUM_BYTES 4 \
  CONFIG.S05_NUM_BYTES 4 \
  CONFIG.S06_NUM_BYTES 4 \
  CONFIG.S07_NUM_BYTES 4 \
  CONFIG.S08_NUM_BYTES 4 \
  CONFIG.S09_NUM_BYTES 4 \
  CONFIG.S10_NUM_BYTES 4 \
  CONFIG.S11_NUM_BYTES 4 \
  CONFIG.S12_NUM_BYTES 4 \
  CONFIG.S13_NUM_BYTES 4 \
  CONFIG.S14_NUM_BYTES 4 \
  CONFIG.S15_NUM_BYTES 4 \
  CONFIG.SC_ROUTE_WIDTH 3 \
  CONFIG.USER_WIDTH 0 \
] [get_bd_cells s00_b_node]

# ---- hierarchy /m00_nodes ----
current_bd_instance /m00_nodes
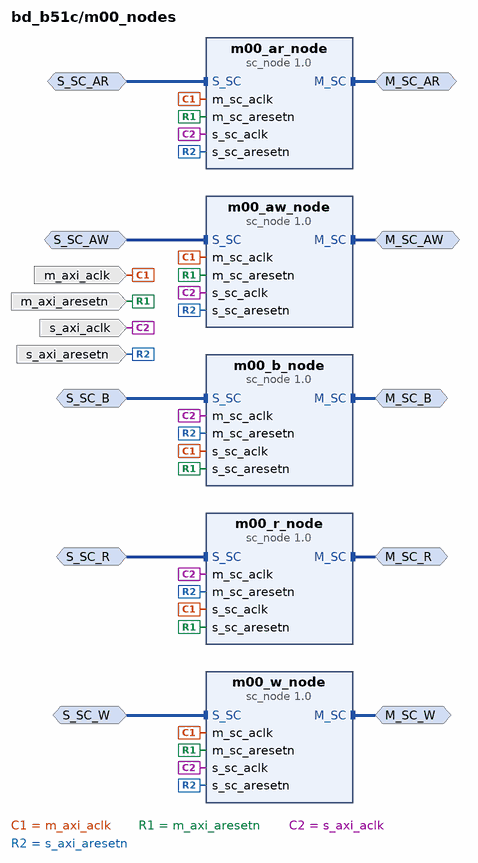
[diagram p6: block diagram inside /m00_nodes]
create_bd_intf_pin -mode Master -vlnv xilinx.com:interface:sc_rtl:1.0 M_SC_AR
create_bd_intf_pin -mode Slave -vlnv xilinx.com:interface:sc_rtl:1.0 S_SC_AR
create_bd_intf_pin -mode Master -vlnv xilinx.com:interface:sc_rtl:1.0 M_SC_R
create_bd_intf_pin -mode Slave -vlnv xilinx.com:interface:sc_rtl:1.0 S_SC_R
create_bd_intf_pin -mode Master -vlnv xilinx.com:interface:sc_rtl:1.0 M_SC_AW
create_bd_intf_pin -mode Slave -vlnv xilinx.com:interface:sc_rtl:1.0 S_SC_AW
create_bd_intf_pin -mode Master -vlnv xilinx.com:interface:sc_rtl:1.0 M_SC_W
create_bd_intf_pin -mode Slave -vlnv xilinx.com:interface:sc_rtl:1.0 S_SC_W
create_bd_intf_pin -mode Master -vlnv xilinx.com:interface:sc_rtl:1.0 M_SC_B
create_bd_intf_pin -mode Slave -vlnv xilinx.com:interface:sc_rtl:1.0 S_SC_B
create_bd_pin -dir I -type clk s_axi_aclk
create_bd_pin -dir I -type rst s_axi_aresetn
create_bd_pin -dir I -type clk m_axi_aclk
create_bd_pin -dir I -type rst m_axi_aresetn

create_bd_cell -type ip -vlnv xilinx.com:ip:sc_node:1.0 m00_ar_node
set_property -dict [list \
  CONFIG.ACLK_RELATIONSHIP 1 \
  CONFIG.ADDR_WIDTH 32 \
  CONFIG.CHANNEL 2 \
  CONFIG.FIFO_TYPE 2 \
  CONFIG.ID_WIDTH 1 \
  CONFIG.M00_NUM_BYTES 4 \
  CONFIG.M01_NUM_BYTES 4 \
  CONFIG.M02_NUM_BYTES 4 \
  CONFIG.M03_NUM_BYTES 4 \
  CONFIG.M04_NUM_BYTES 4 \
  CONFIG.M05_NUM_BYTES 4 \
  CONFIG.M06_NUM_BYTES 4 \
  CONFIG.M07_NUM_BYTES 4 \
  CONFIG.M08_NUM_BYTES 4 \
  CONFIG.M09_NUM_BYTES 4 \
  CONFIG.M10_NUM_BYTES 4 \
  CONFIG.M11_NUM_BYTES 4 \
  CONFIG.M12_NUM_BYTES 4 \
  CONFIG.M13_NUM_BYTES 4 \
  CONFIG.M14_NUM_BYTES 4 \
  CONFIG.M15_NUM_BYTES 4 \
  CONFIG.MAX_PAYLD_BYTES 4 \
  CONFIG.M_SEND_PIPELINE 0 \
  CONFIG.NUM_MI 1 \
  CONFIG.NUM_OUTSTANDING 8 \
  CONFIG.NUM_SI 1 \
  CONFIG.PAYLD_WIDTH 141 \
  CONFIG.S00_NUM_BYTES 4 \
  CONFIG.S01_NUM_BYTES 4 \
  CONFIG.S02_NUM_BYTES 4 \
  CONFIG.S03_NUM_BYTES 4 \
  CONFIG.S04_NUM_BYTES 4 \
  CONFIG.S05_NUM_BYTES 4 \
  CONFIG.S06_NUM_BYTES 4 \
  CONFIG.S07_NUM_BYTES 4 \
  CONFIG.S08_NUM_BYTES 4 \
  CONFIG.S09_NUM_BYTES 4 \
  CONFIG.S10_NUM_BYTES 4 \
  CONFIG.S11_NUM_BYTES 4 \
  CONFIG.S12_NUM_BYTES 4 \
  CONFIG.S13_NUM_BYTES 4 \
  CONFIG.S14_NUM_BYTES 4 \
  CONFIG.S15_NUM_BYTES 4 \
  CONFIG.SC_ROUTE_WIDTH 4 \
  CONFIG.USER_WIDTH 0 \
] [get_bd_cells m00_ar_node]
create_bd_cell -type ip -vlnv xilinx.com:ip:sc_node:1.0 m00_r_node
set_property -dict [list \
  CONFIG.ACLK_RELATIONSHIP 1 \
  CONFIG.ADDR_WIDTH 32 \
  CONFIG.CHANNEL 0 \
  CONFIG.FIFO_TYPE 2 \
  CONFIG.ID_WIDTH 1 \
  CONFIG.M00_NUM_BYTES 4 \
  CONFIG.M01_NUM_BYTES 4 \
  CONFIG.M02_NUM_BYTES 4 \
  CONFIG.M03_NUM_BYTES 4 \
  CONFIG.M04_NUM_BYTES 4 \
  CONFIG.M05_NUM_BYTES 4 \
  CONFIG.M06_NUM_BYTES 4 \
  CONFIG.M07_NUM_BYTES 4 \
  CONFIG.M08_NUM_BYTES 4 \
  CONFIG.M09_NUM_BYTES 4 \
  CONFIG.M10_NUM_BYTES 4 \
  CONFIG.M11_NUM_BYTES 4 \
  CONFIG.M12_NUM_BYTES 4 \
  CONFIG.M13_NUM_BYTES 4 \
  CONFIG.M14_NUM_BYTES 4 \
  CONFIG.M15_NUM_BYTES 4 \
  CONFIG.MAX_PAYLD_BYTES 4 \
  CONFIG.NUM_MI 1 \
  CONFIG.NUM_OUTSTANDING 8 \
  CONFIG.NUM_SI 1 \
  CONFIG.PAYLD_WIDTH 53 \
  CONFIG.S00_NUM_BYTES 4 \
  CONFIG.S01_NUM_BYTES 4 \
  CONFIG.S02_NUM_BYTES 4 \
  CONFIG.S03_NUM_BYTES 4 \
  CONFIG.S04_NUM_BYTES 4 \
  CONFIG.S05_NUM_BYTES 4 \
  CONFIG.S06_NUM_BYTES 4 \
  CONFIG.S07_NUM_BYTES 4 \
  CONFIG.S08_NUM_BYTES 4 \
  CONFIG.S09_NUM_BYTES 4 \
  CONFIG.S10_NUM_BYTES 4 \
  CONFIG.S11_NUM_BYTES 4 \
  CONFIG.S12_NUM_BYTES 4 \
  CONFIG.S13_NUM_BYTES 4 \
  CONFIG.S14_NUM_BYTES 4 \
  CONFIG.S15_NUM_BYTES 4 \
  CONFIG.SC_ROUTE_WIDTH 3 \
  CONFIG.USER_BITS_PER_BYTE 0 \
  CONFIG.USER_WIDTH 0 \
] [get_bd_cells m00_r_node]
create_bd_cell -type ip -vlnv xilinx.com:ip:sc_node:1.0 m00_aw_node
set_property -dict [list \
  CONFIG.ACLK_RELATIONSHIP 1 \
  CONFIG.ADDR_WIDTH 32 \
  CONFIG.CHANNEL 3 \
  CONFIG.FIFO_TYPE 2 \
  CONFIG.ID_WIDTH 1 \
  CONFIG.M00_NUM_BYTES 4 \
  CONFIG.M01_NUM_BYTES 4 \
  CONFIG.M02_NUM_BYTES 4 \
  CONFIG.M03_NUM_BYTES 4 \
  CONFIG.M04_NUM_BYTES 4 \
  CONFIG.M05_NUM_BYTES 4 \
  CONFIG.M06_NUM_BYTES 4 \
  CONFIG.M07_NUM_BYTES 4 \
  CONFIG.M08_NUM_BYTES 4 \
  CONFIG.M09_NUM_BYTES 4 \
  CONFIG.M10_NUM_BYTES 4 \
  CONFIG.M11_NUM_BYTES 4 \
  CONFIG.M12_NUM_BYTES 4 \
  CONFIG.M13_NUM_BYTES 4 \
  CONFIG.M14_NUM_BYTES 4 \
  CONFIG.M15_NUM_BYTES 4 \
  CONFIG.MAX_PAYLD_BYTES 4 \
  CONFIG.M_SEND_PIPELINE 0 \
  CONFIG.NUM_MI 1 \
  CONFIG.NUM_OUTSTANDING 8 \
  CONFIG.NUM_SI 1 \
  CONFIG.PAYLD_WIDTH 141 \
  CONFIG.S00_NUM_BYTES 4 \
  CONFIG.S01_NUM_BYTES 4 \
  CONFIG.S02_NUM_BYTES 4 \
  CONFIG.S03_NUM_BYTES 4 \
  CONFIG.S04_NUM_BYTES 4 \
  CONFIG.S05_NUM_BYTES 4 \
  CONFIG.S06_NUM_BYTES 4 \
  CONFIG.S07_NUM_BYTES 4 \
  CONFIG.S08_NUM_BYTES 4 \
  CONFIG.S09_NUM_BYTES 4 \
  CONFIG.S10_NUM_BYTES 4 \
  CONFIG.S11_NUM_BYTES 4 \
  CONFIG.S12_NUM_BYTES 4 \
  CONFIG.S13_NUM_BYTES 4 \
  CONFIG.S14_NUM_BYTES 4 \
  CONFIG.S15_NUM_BYTES 4 \
  CONFIG.SC_ROUTE_WIDTH 4 \
  CONFIG.USER_WIDTH 0 \
] [get_bd_cells m00_aw_node]
create_bd_cell -type ip -vlnv xilinx.com:ip:sc_node:1.0 m00_w_node
set_property -dict [list \
  CONFIG.ACLK_RELATIONSHIP 1 \
  CONFIG.ADDR_WIDTH 32 \
  CONFIG.CHANNEL 1 \
  CONFIG.FIFO_TYPE 2 \
  CONFIG.ID_WIDTH 1 \
  CONFIG.M00_NUM_BYTES 4 \
  CONFIG.M01_NUM_BYTES 4 \
  CONFIG.M02_NUM_BYTES 4 \
  CONFIG.M03_NUM_BYTES 4 \
  CONFIG.M04_NUM_BYTES 4 \
  CONFIG.M05_NUM_BYTES 4 \
  CONFIG.M06_NUM_BYTES 4 \
  CONFIG.M07_NUM_BYTES 4 \
  CONFIG.M08_NUM_BYTES 4 \
  CONFIG.M09_NUM_BYTES 4 \
  CONFIG.M10_NUM_BYTES 4 \
  CONFIG.M11_NUM_BYTES 4 \
  CONFIG.M12_NUM_BYTES 4 \
  CONFIG.M13_NUM_BYTES 4 \
  CONFIG.M14_NUM_BYTES 4 \
  CONFIG.M15_NUM_BYTES 4 \
  CONFIG.MAX_PAYLD_BYTES 4 \
  CONFIG.M_SEND_PIPELINE 0 \
  CONFIG.NUM_MI 1 \
  CONFIG.NUM_OUTSTANDING 8 \
  CONFIG.NUM_SI 1 \
  CONFIG.PAYLD_WIDTH 55 \
  CONFIG.S00_NUM_BYTES 4 \
  CONFIG.S01_NUM_BYTES 4 \
  CONFIG.S02_NUM_BYTES 4 \
  CONFIG.S03_NUM_BYTES 4 \
  CONFIG.S04_NUM_BYTES 4 \
  CONFIG.S05_NUM_BYTES 4 \
  CONFIG.S06_NUM_BYTES 4 \
  CONFIG.S07_NUM_BYTES 4 \
  CONFIG.S08_NUM_BYTES 4 \
  CONFIG.S09_NUM_BYTES 4 \
  CONFIG.S10_NUM_BYTES 4 \
  CONFIG.S11_NUM_BYTES 4 \
  CONFIG.S12_NUM_BYTES 4 \
  CONFIG.S13_NUM_BYTES 4 \
  CONFIG.S14_NUM_BYTES 4 \
  CONFIG.S15_NUM_BYTES 4 \
  CONFIG.SC_ROUTE_WIDTH 4 \
  CONFIG.USER_BITS_PER_BYTE 0 \
  CONFIG.USER_WIDTH 0 \
] [get_bd_cells m00_w_node]
create_bd_cell -type ip -vlnv xilinx.com:ip:sc_node:1.0 m00_b_node
set_property -dict [list \
  CONFIG.ACLK_RELATIONSHIP 1 \
  CONFIG.ADDR_WIDTH 32 \
  CONFIG.CHANNEL 4 \
  CONFIG.FIFO_TYPE 2 \
  CONFIG.ID_WIDTH 1 \
  CONFIG.M00_NUM_BYTES 4 \
  CONFIG.M01_NUM_BYTES 4 \
  CONFIG.M02_NUM_BYTES 4 \
  CONFIG.M03_NUM_BYTES 4 \
  CONFIG.M04_NUM_BYTES 4 \
  CONFIG.M05_NUM_BYTES 4 \
  CONFIG.M06_NUM_BYTES 4 \
  CONFIG.M07_NUM_BYTES 4 \
  CONFIG.M08_NUM_BYTES 4 \
  CONFIG.M09_NUM_BYTES 4 \
  CONFIG.M10_NUM_BYTES 4 \
  CONFIG.M11_NUM_BYTES 4 \
  CONFIG.M12_NUM_BYTES 4 \
  CONFIG.M13_NUM_BYTES 4 \
  CONFIG.M14_NUM_BYTES 4 \
  CONFIG.M15_NUM_BYTES 4 \
  CONFIG.MAX_PAYLD_BYTES 4 \
  CONFIG.NUM_MI 1 \
  CONFIG.NUM_OUTSTANDING 8 \
  CONFIG.NUM_SI 1 \
  CONFIG.PAYLD_WIDTH 7 \
  CONFIG.S00_NUM_BYTES 4 \
  CONFIG.S01_NUM_BYTES 4 \
  CONFIG.S02_NUM_BYTES 4 \
  CONFIG.S03_NUM_BYTES 4 \
  CONFIG.S04_NUM_BYTES 4 \
  CONFIG.S05_NUM_BYTES 4 \
  CONFIG.S06_NUM_BYTES 4 \
  CONFIG.S07_NUM_BYTES 4 \
  CONFIG.S08_NUM_BYTES 4 \
  CONFIG.S09_NUM_BYTES 4 \
  CONFIG.S10_NUM_BYTES 4 \
  CONFIG.S11_NUM_BYTES 4 \
  CONFIG.S12_NUM_BYTES 4 \
  CONFIG.S13_NUM_BYTES 4 \
  CONFIG.S14_NUM_BYTES 4 \
  CONFIG.S15_NUM_BYTES 4 \
  CONFIG.SC_ROUTE_WIDTH 3 \
  CONFIG.USER_WIDTH 0 \
] [get_bd_cells m00_b_node]

# ---- hierarchy /m00_exit_pipeline ----
current_bd_instance /m00_exit_pipeline
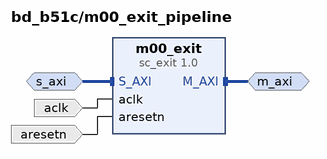
[diagram p7: block diagram inside /m00_exit_pipeline]
create_bd_intf_pin -mode Slave -vlnv xilinx.com:interface:aximm_rtl:1.0 s_axi
create_bd_intf_pin -mode Master -vlnv xilinx.com:interface:aximm_rtl:1.0 m_axi
create_bd_pin -dir I -type clk aclk
create_bd_pin -dir I -type rst aresetn

create_bd_cell -type ip -vlnv xilinx.com:ip:sc_exit:1.0 m00_exit
set_property -dict [list \
  CONFIG.ADDR_WIDTH 9 \
  CONFIG.ENABLE_PIPELINING 0 \
  CONFIG.HAS_BURST 0 \
  CONFIG.IS_CASCADED 0 \
  CONFIG.MEP_IDENTIFIER_WIDTH 1 \
  CONFIG.M_MAX_BURST_LENGTH 0 \
  CONFIG.M_PROTOCOL AXI4LITE \
  CONFIG.NUM_MSC 2 \
  CONFIG.NUM_READ_OUTSTANDING 8 \
  CONFIG.NUM_WRITE_OUTSTANDING 8 \
  CONFIG.RDATA_WIDTH 32 \
  CONFIG.READ_WRITE_MODE READ_WRITE \
  CONFIG.SINGLE_ISSUING 1 \
  CONFIG.SSC000_ROUTE 0b101 \
  CONFIG.SSC001_ROUTE 0b111 \
  CONFIG.SSC_ROUTE_WIDTH 3 \
  CONFIG.S_ID_WIDTH 1 \
  CONFIG.WDATA_WIDTH 32 \
] [get_bd_cells m00_exit]

# ---- hierarchy /m01_nodes ----
current_bd_instance /m01_nodes
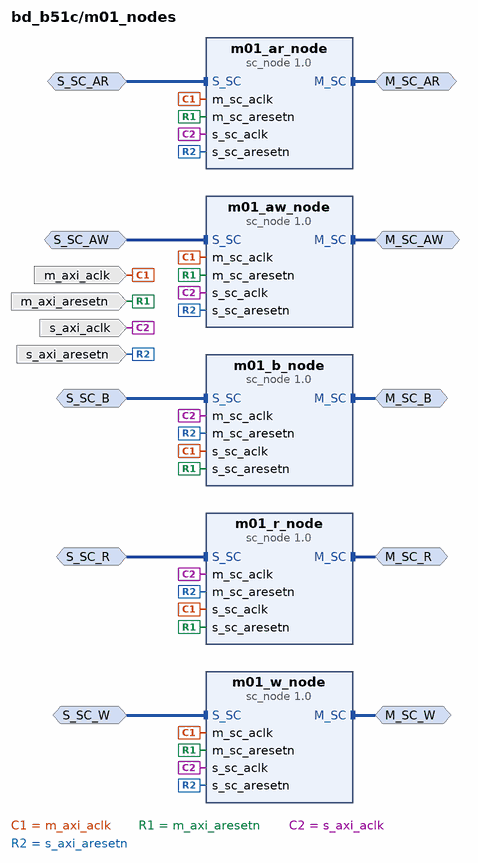
[diagram p8: block diagram inside /m01_nodes]
create_bd_intf_pin -mode Master -vlnv xilinx.com:interface:sc_rtl:1.0 M_SC_AR
create_bd_intf_pin -mode Slave -vlnv xilinx.com:interface:sc_rtl:1.0 S_SC_AR
create_bd_intf_pin -mode Master -vlnv xilinx.com:interface:sc_rtl:1.0 M_SC_R
create_bd_intf_pin -mode Slave -vlnv xilinx.com:interface:sc_rtl:1.0 S_SC_R
create_bd_intf_pin -mode Master -vlnv xilinx.com:interface:sc_rtl:1.0 M_SC_AW
create_bd_intf_pin -mode Slave -vlnv xilinx.com:interface:sc_rtl:1.0 S_SC_AW
create_bd_intf_pin -mode Master -vlnv xilinx.com:interface:sc_rtl:1.0 M_SC_W
create_bd_intf_pin -mode Slave -vlnv xilinx.com:interface:sc_rtl:1.0 S_SC_W
create_bd_intf_pin -mode Master -vlnv xilinx.com:interface:sc_rtl:1.0 M_SC_B
create_bd_intf_pin -mode Slave -vlnv xilinx.com:interface:sc_rtl:1.0 S_SC_B
create_bd_pin -dir I -type clk s_axi_aclk
create_bd_pin -dir I -type rst s_axi_aresetn
create_bd_pin -dir I -type clk m_axi_aclk
create_bd_pin -dir I -type rst m_axi_aresetn

create_bd_cell -type ip -vlnv xilinx.com:ip:sc_node:1.0 m01_ar_node
set_property -dict [list \
  CONFIG.ACLK_RELATIONSHIP 1 \
  CONFIG.ADDR_WIDTH 32 \
  CONFIG.CHANNEL 2 \
  CONFIG.FIFO_TYPE 2 \
  CONFIG.ID_WIDTH 1 \
  CONFIG.M00_NUM_BYTES 4 \
  CONFIG.M01_NUM_BYTES 4 \
  CONFIG.M02_NUM_BYTES 4 \
  CONFIG.M03_NUM_BYTES 4 \
  CONFIG.M04_NUM_BYTES 4 \
  CONFIG.M05_NUM_BYTES 4 \
  CONFIG.M06_NUM_BYTES 4 \
  CONFIG.M07_NUM_BYTES 4 \
  CONFIG.M08_NUM_BYTES 4 \
  CONFIG.M09_NUM_BYTES 4 \
  CONFIG.M10_NUM_BYTES 4 \
  CONFIG.M11_NUM_BYTES 4 \
  CONFIG.M12_NUM_BYTES 4 \
  CONFIG.M13_NUM_BYTES 4 \
  CONFIG.M14_NUM_BYTES 4 \
  CONFIG.M15_NUM_BYTES 4 \
  CONFIG.MAX_PAYLD_BYTES 4 \
  CONFIG.M_SEND_PIPELINE 0 \
  CONFIG.NUM_MI 1 \
  CONFIG.NUM_OUTSTANDING 8 \
  CONFIG.NUM_SI 1 \
  CONFIG.PAYLD_WIDTH 141 \
  CONFIG.S00_NUM_BYTES 4 \
  CONFIG.S01_NUM_BYTES 4 \
  CONFIG.S02_NUM_BYTES 4 \
  CONFIG.S03_NUM_BYTES 4 \
  CONFIG.S04_NUM_BYTES 4 \
  CONFIG.S05_NUM_BYTES 4 \
  CONFIG.S06_NUM_BYTES 4 \
  CONFIG.S07_NUM_BYTES 4 \
  CONFIG.S08_NUM_BYTES 4 \
  CONFIG.S09_NUM_BYTES 4 \
  CONFIG.S10_NUM_BYTES 4 \
  CONFIG.S11_NUM_BYTES 4 \
  CONFIG.S12_NUM_BYTES 4 \
  CONFIG.S13_NUM_BYTES 4 \
  CONFIG.S14_NUM_BYTES 4 \
  CONFIG.S15_NUM_BYTES 4 \
  CONFIG.SC_ROUTE_WIDTH 4 \
  CONFIG.USER_WIDTH 0 \
] [get_bd_cells m01_ar_node]
create_bd_cell -type ip -vlnv xilinx.com:ip:sc_node:1.0 m01_r_node
set_property -dict [list \
  CONFIG.ACLK_RELATIONSHIP 1 \
  CONFIG.ADDR_WIDTH 32 \
  CONFIG.CHANNEL 0 \
  CONFIG.FIFO_TYPE 2 \
  CONFIG.ID_WIDTH 1 \
  CONFIG.M00_NUM_BYTES 4 \
  CONFIG.M01_NUM_BYTES 4 \
  CONFIG.M02_NUM_BYTES 4 \
  CONFIG.M03_NUM_BYTES 4 \
  CONFIG.M04_NUM_BYTES 4 \
  CONFIG.M05_NUM_BYTES 4 \
  CONFIG.M06_NUM_BYTES 4 \
  CONFIG.M07_NUM_BYTES 4 \
  CONFIG.M08_NUM_BYTES 4 \
  CONFIG.M09_NUM_BYTES 4 \
  CONFIG.M10_NUM_BYTES 4 \
  CONFIG.M11_NUM_BYTES 4 \
  CONFIG.M12_NUM_BYTES 4 \
  CONFIG.M13_NUM_BYTES 4 \
  CONFIG.M14_NUM_BYTES 4 \
  CONFIG.M15_NUM_BYTES 4 \
  CONFIG.MAX_PAYLD_BYTES 4 \
  CONFIG.NUM_MI 1 \
  CONFIG.NUM_OUTSTANDING 8 \
  CONFIG.NUM_SI 1 \
  CONFIG.PAYLD_WIDTH 53 \
  CONFIG.S00_NUM_BYTES 4 \
  CONFIG.S01_NUM_BYTES 4 \
  CONFIG.S02_NUM_BYTES 4 \
  CONFIG.S03_NUM_BYTES 4 \
  CONFIG.S04_NUM_BYTES 4 \
  CONFIG.S05_NUM_BYTES 4 \
  CONFIG.S06_NUM_BYTES 4 \
  CONFIG.S07_NUM_BYTES 4 \
  CONFIG.S08_NUM_BYTES 4 \
  CONFIG.S09_NUM_BYTES 4 \
  CONFIG.S10_NUM_BYTES 4 \
  CONFIG.S11_NUM_BYTES 4 \
  CONFIG.S12_NUM_BYTES 4 \
  CONFIG.S13_NUM_BYTES 4 \
  CONFIG.S14_NUM_BYTES 4 \
  CONFIG.S15_NUM_BYTES 4 \
  CONFIG.SC_ROUTE_WIDTH 3 \
  CONFIG.USER_BITS_PER_BYTE 0 \
  CONFIG.USER_WIDTH 0 \
] [get_bd_cells m01_r_node]
create_bd_cell -type ip -vlnv xilinx.com:ip:sc_node:1.0 m01_aw_node
set_property -dict [list \
  CONFIG.ACLK_RELATIONSHIP 1 \
  CONFIG.ADDR_WIDTH 32 \
  CONFIG.CHANNEL 3 \
  CONFIG.FIFO_TYPE 2 \
  CONFIG.ID_WIDTH 1 \
  CONFIG.M00_NUM_BYTES 4 \
  CONFIG.M01_NUM_BYTES 4 \
  CONFIG.M02_NUM_BYTES 4 \
  CONFIG.M03_NUM_BYTES 4 \
  CONFIG.M04_NUM_BYTES 4 \
  CONFIG.M05_NUM_BYTES 4 \
  CONFIG.M06_NUM_BYTES 4 \
  CONFIG.M07_NUM_BYTES 4 \
  CONFIG.M08_NUM_BYTES 4 \
  CONFIG.M09_NUM_BYTES 4 \
  CONFIG.M10_NUM_BYTES 4 \
  CONFIG.M11_NUM_BYTES 4 \
  CONFIG.M12_NUM_BYTES 4 \
  CONFIG.M13_NUM_BYTES 4 \
  CONFIG.M14_NUM_BYTES 4 \
  CONFIG.M15_NUM_BYTES 4 \
  CONFIG.MAX_PAYLD_BYTES 4 \
  CONFIG.M_SEND_PIPELINE 0 \
  CONFIG.NUM_MI 1 \
  CONFIG.NUM_OUTSTANDING 8 \
  CONFIG.NUM_SI 1 \
  CONFIG.PAYLD_WIDTH 141 \
  CONFIG.S00_NUM_BYTES 4 \
  CONFIG.S01_NUM_BYTES 4 \
  CONFIG.S02_NUM_BYTES 4 \
  CONFIG.S03_NUM_BYTES 4 \
  CONFIG.S04_NUM_BYTES 4 \
  CONFIG.S05_NUM_BYTES 4 \
  CONFIG.S06_NUM_BYTES 4 \
  CONFIG.S07_NUM_BYTES 4 \
  CONFIG.S08_NUM_BYTES 4 \
  CONFIG.S09_NUM_BYTES 4 \
  CONFIG.S10_NUM_BYTES 4 \
  CONFIG.S11_NUM_BYTES 4 \
  CONFIG.S12_NUM_BYTES 4 \
  CONFIG.S13_NUM_BYTES 4 \
  CONFIG.S14_NUM_BYTES 4 \
  CONFIG.S15_NUM_BYTES 4 \
  CONFIG.SC_ROUTE_WIDTH 4 \
  CONFIG.USER_WIDTH 0 \
] [get_bd_cells m01_aw_node]
create_bd_cell -type ip -vlnv xilinx.com:ip:sc_node:1.0 m01_w_node
set_property -dict [list \
  CONFIG.ACLK_RELATIONSHIP 1 \
  CONFIG.ADDR_WIDTH 32 \
  CONFIG.CHANNEL 1 \
  CONFIG.FIFO_TYPE 2 \
  CONFIG.ID_WIDTH 1 \
  CONFIG.M00_NUM_BYTES 4 \
  CONFIG.M01_NUM_BYTES 4 \
  CONFIG.M02_NUM_BYTES 4 \
  CONFIG.M03_NUM_BYTES 4 \
  CONFIG.M04_NUM_BYTES 4 \
  CONFIG.M05_NUM_BYTES 4 \
  CONFIG.M06_NUM_BYTES 4 \
  CONFIG.M07_NUM_BYTES 4 \
  CONFIG.M08_NUM_BYTES 4 \
  CONFIG.M09_NUM_BYTES 4 \
  CONFIG.M10_NUM_BYTES 4 \
  CONFIG.M11_NUM_BYTES 4 \
  CONFIG.M12_NUM_BYTES 4 \
  CONFIG.M13_NUM_BYTES 4 \
  CONFIG.M14_NUM_BYTES 4 \
  CONFIG.M15_NUM_BYTES 4 \
  CONFIG.MAX_PAYLD_BYTES 4 \
  CONFIG.M_SEND_PIPELINE 0 \
  CONFIG.NUM_MI 1 \
  CONFIG.NUM_OUTSTANDING 8 \
  CONFIG.NUM_SI 1 \
  CONFIG.PAYLD_WIDTH 55 \
  CONFIG.S00_NUM_BYTES 4 \
  CONFIG.S01_NUM_BYTES 4 \
  CONFIG.S02_NUM_BYTES 4 \
  CONFIG.S03_NUM_BYTES 4 \
  CONFIG.S04_NUM_BYTES 4 \
  CONFIG.S05_NUM_BYTES 4 \
  CONFIG.S06_NUM_BYTES 4 \
  CONFIG.S07_NUM_BYTES 4 \
  CONFIG.S08_NUM_BYTES 4 \
  CONFIG.S09_NUM_BYTES 4 \
  CONFIG.S10_NUM_BYTES 4 \
  CONFIG.S11_NUM_BYTES 4 \
  CONFIG.S12_NUM_BYTES 4 \
  CONFIG.S13_NUM_BYTES 4 \
  CONFIG.S14_NUM_BYTES 4 \
  CONFIG.S15_NUM_BYTES 4 \
  CONFIG.SC_ROUTE_WIDTH 4 \
  CONFIG.USER_BITS_PER_BYTE 0 \
  CONFIG.USER_WIDTH 0 \
] [get_bd_cells m01_w_node]
create_bd_cell -type ip -vlnv xilinx.com:ip:sc_node:1.0 m01_b_node
set_property -dict [list \
  CONFIG.ACLK_RELATIONSHIP 1 \
  CONFIG.ADDR_WIDTH 32 \
  CONFIG.CHANNEL 4 \
  CONFIG.FIFO_TYPE 2 \
  CONFIG.ID_WIDTH 1 \
  CONFIG.M00_NUM_BYTES 4 \
  CONFIG.M01_NUM_BYTES 4 \
  CONFIG.M02_NUM_BYTES 4 \
  CONFIG.M03_NUM_BYTES 4 \
  CONFIG.M04_NUM_BYTES 4 \
  CONFIG.M05_NUM_BYTES 4 \
  CONFIG.M06_NUM_BYTES 4 \
  CONFIG.M07_NUM_BYTES 4 \
  CONFIG.M08_NUM_BYTES 4 \
  CONFIG.M09_NUM_BYTES 4 \
  CONFIG.M10_NUM_BYTES 4 \
  CONFIG.M11_NUM_BYTES 4 \
  CONFIG.M12_NUM_BYTES 4 \
  CONFIG.M13_NUM_BYTES 4 \
  CONFIG.M14_NUM_BYTES 4 \
  CONFIG.M15_NUM_BYTES 4 \
  CONFIG.MAX_PAYLD_BYTES 4 \
  CONFIG.NUM_MI 1 \
  CONFIG.NUM_OUTSTANDING 8 \
  CONFIG.NUM_SI 1 \
  CONFIG.PAYLD_WIDTH 7 \
  CONFIG.S00_NUM_BYTES 4 \
  CONFIG.S01_NUM_BYTES 4 \
  CONFIG.S02_NUM_BYTES 4 \
  CONFIG.S03_NUM_BYTES 4 \
  CONFIG.S04_NUM_BYTES 4 \
  CONFIG.S05_NUM_BYTES 4 \
  CONFIG.S06_NUM_BYTES 4 \
  CONFIG.S07_NUM_BYTES 4 \
  CONFIG.S08_NUM_BYTES 4 \
  CONFIG.S09_NUM_BYTES 4 \
  CONFIG.S10_NUM_BYTES 4 \
  CONFIG.S11_NUM_BYTES 4 \
  CONFIG.S12_NUM_BYTES 4 \
  CONFIG.S13_NUM_BYTES 4 \
  CONFIG.S14_NUM_BYTES 4 \
  CONFIG.S15_NUM_BYTES 4 \
  CONFIG.SC_ROUTE_WIDTH 3 \
  CONFIG.USER_WIDTH 0 \
] [get_bd_cells m01_b_node]
